# Altium schematic sheet Analog Inputs.SchDoc
size A4; SheetNumber: 4; SheetTotal: 7
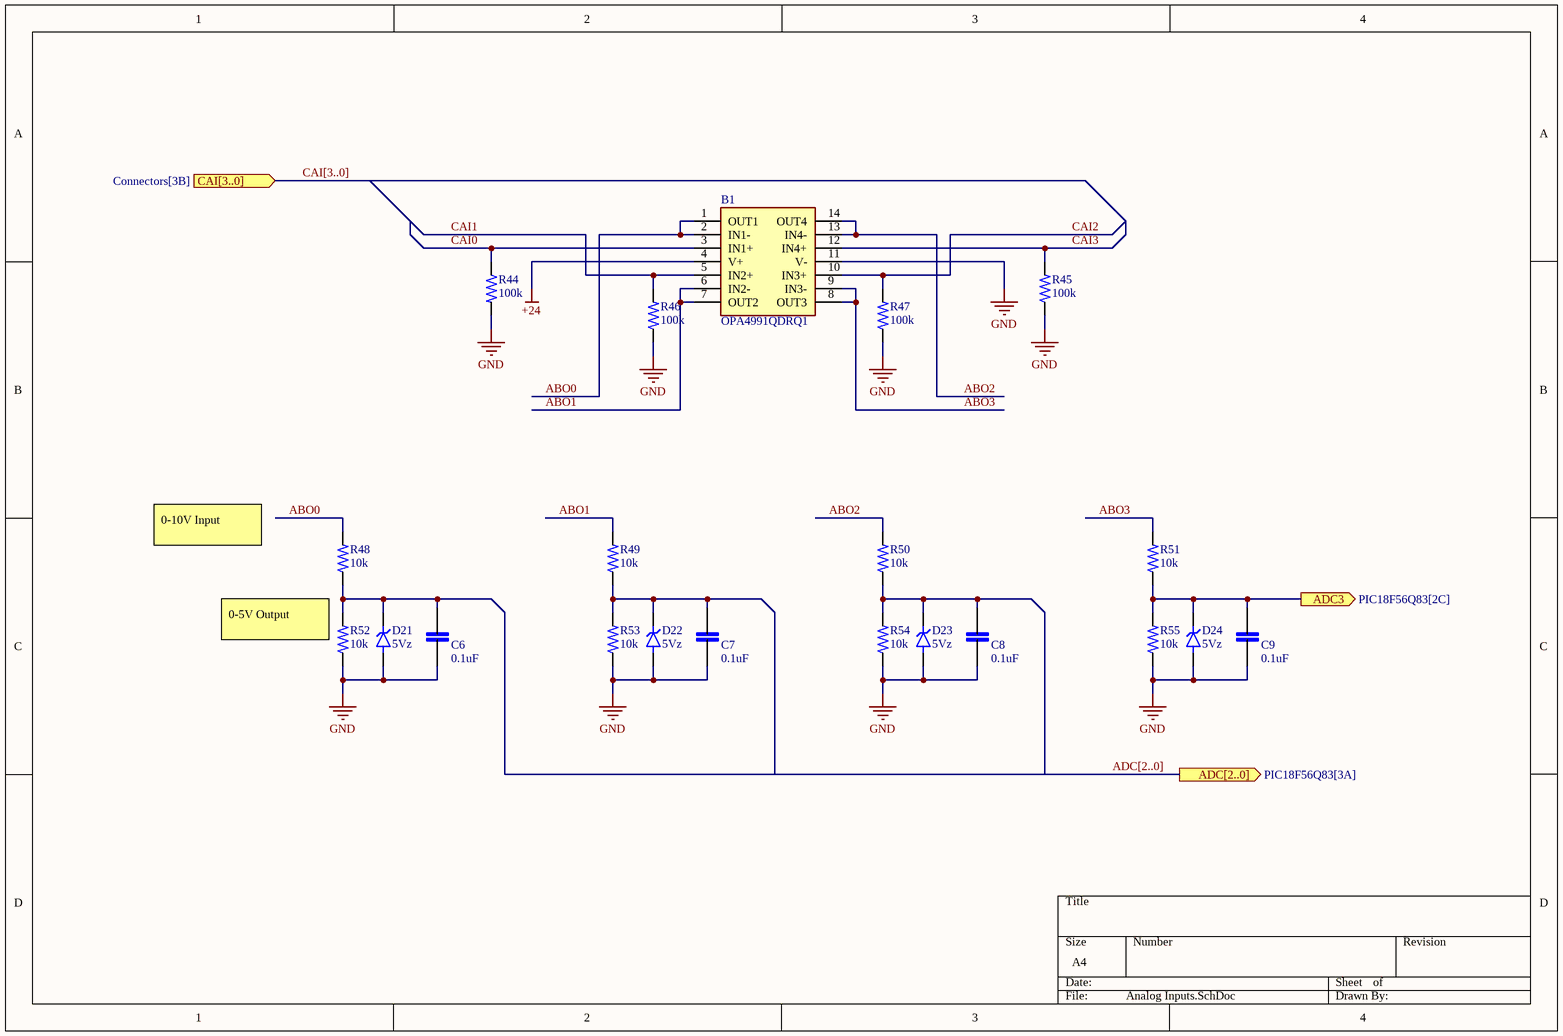
[diagram p0: Analog Inputs.SchDoc]

## Parts
B1  OPA4991QDRQ1  [OPA4991QDRQ1]
C6  0.1uF  [0805]
C7  0.1uF  [0805]
C8  0.1uF  [0805]
C9  0.1uF  [0805]
D21  5Vz  [SOD123]
D22  5Vz  [SOD123]
D23  5Vz  [SOD123]
D24  5Vz  [SOD123]
R44  100k  [0805]
R45  100k  [0805]
R46  100k  [0805]
R47  100k  [0805]
R48  10k  [0805]
R49  10k  [0805]
R50  10k  [0805]
R51  10k  [0805]
R52  10k  [0805]
R53  10k  [0805]
R54  10k  [0805]
R55  10k  [0805]

## Ports
ADC3 (out, see PIC18F56Q83[2C]), ADC[2..0] (out, see PIC18F56Q83[3A]), CAI[3..0] (in, see Connectors[3B])

## Nets
+24: B1.4(V+)
GND: B1.11(V-) C6.1 C7.1 C8.1 C9.1 D21.2(A) D22.2(A) D23.2(A) D24.2(A) R44.2 R45.1 R46.1 R47.1 R52.1 R53.1 R54.1 R55.1
ABO0: B1.1(OUT1) B1.2(IN1-) R48.2
ABO1: B1.6(IN2-) B1.7(OUT2) R49.2
ABO2: B1.13(IN4-) B1.14(OUT4) R50.2
ABO3: B1.8(OUT3) B1.9(IN3-) R51.2
ADC3: C9.2 D24.1(K) R51.1 R55.2 ; port ADC3
CAI0: B1.3(IN1+) R44.1
CAI1: B1.5(IN2+) R46.2
CAI2: B1.10(IN3+) R47.2
CAI3: B1.12(IN4+) R45.2
NetC6_2: C6.2 D21.1(K) R48.1 R52.2
NetC7_2: C7.2 D22.1(K) R49.1 R53.2
NetC8_2: C8.2 D23.1(K) R50.1 R54.2

## Buses and harness runs
bus ADC[2..0] = port ADC[2..0]
bus CAI[3..0] = port CAI[3..0]

## Notes on the sheet
- (near R46) Atenção aos Grounds - Não Isolado - Meter Fusível
- 0-10V Input
- (near R52) 0-5V Output

## Library data of the parts
B1 = OPA4991QDRQ1: Operational Amplifiers - Op Amps Automotive-grade, quad, 40-V, 4.5-MHz, low-power operational amplifier; Manufacturer_Name: Texas Instruments; Geometry.Height: 1.75mm; Mouser Part Number: 595-OPA4991QDRQ1; Mouser Price/Stock: https://www.mouser.co.uk/ProductDetail/Texas-Instruments/OPA4991QDRQ1?qs=Rp5uXu7WBW8O3FoPRuKIAQ%3D%3D; Manufacturer_Part_Number: OPA4991QDRQ1; Datasheet Link: https://www.ti.com/lit/ds/symlink/opa4991-q1.pdf?ts=1681108583924&ref_url=https%253A%252F%252Fwww.ti.com%252Fsitesearch%252Fen-us%252Fdocs%252Funiversalsearch.tsp%253FlangPref%253Den-US%2526searchTerm%253DOPA4991QDRQ1%2526nr%253D8
C6-C9 = 0805_Capacitor: MP: LD051A121KAB2A; MF: AVX; SnapEDA_Link: https://www.snapeda.com/parts/LD051A121KAB2A/AVX/view-part/?ref=snap; Package: 0805 AVX; Check_prices: https://www.snapeda.com/parts/LD051A121KAB2A/AVX/view-part/?ref=eda; Purchase-URL: https://pricing.snapeda.com/search/part/LD051A121KAB2A/?ref=eda; Price: None; Value: *; Availability: In Stock
D21-D24 = SOD123 - Zener Diode: MP: 1SMA5926; MF: Taiwan Semiconductor; Package: SMA-2 Taiwan Semiconductor; Availability: In Stock; Purchase-URL: https://pricing.snapeda.com/search/part/1SMA5926/?ref=eda; SnapEDA_Link: https://www.snapeda.com/parts/1SMA5926/Taiwan+Semiconductor/view-part/?ref=snap; Price: None; Check_prices: https://www.snapeda.com/parts/1SMA5926/Taiwan+Semiconductor/view-part/?ref=eda; Value: *
R44-R55 = 0805_Resistor: Power_Rating: .25 W; MP: 2-2176053-0; Tolerance: 1%; Resistance: .33; MF: TE Connectivity; Price: None; Availability: In Stock; EU_RoHS_Compliance: Compliant with Exemptions; Package: 0805; Value: *; SnapEDA_Link: https://www.snapeda.com/parts/2-2176053-0/TE+Connectivity/view-part/?ref=snap; Check_prices: https://www.snapeda.com/parts/2-2176053-0/TE+Connectivity/view-part/?ref=eda